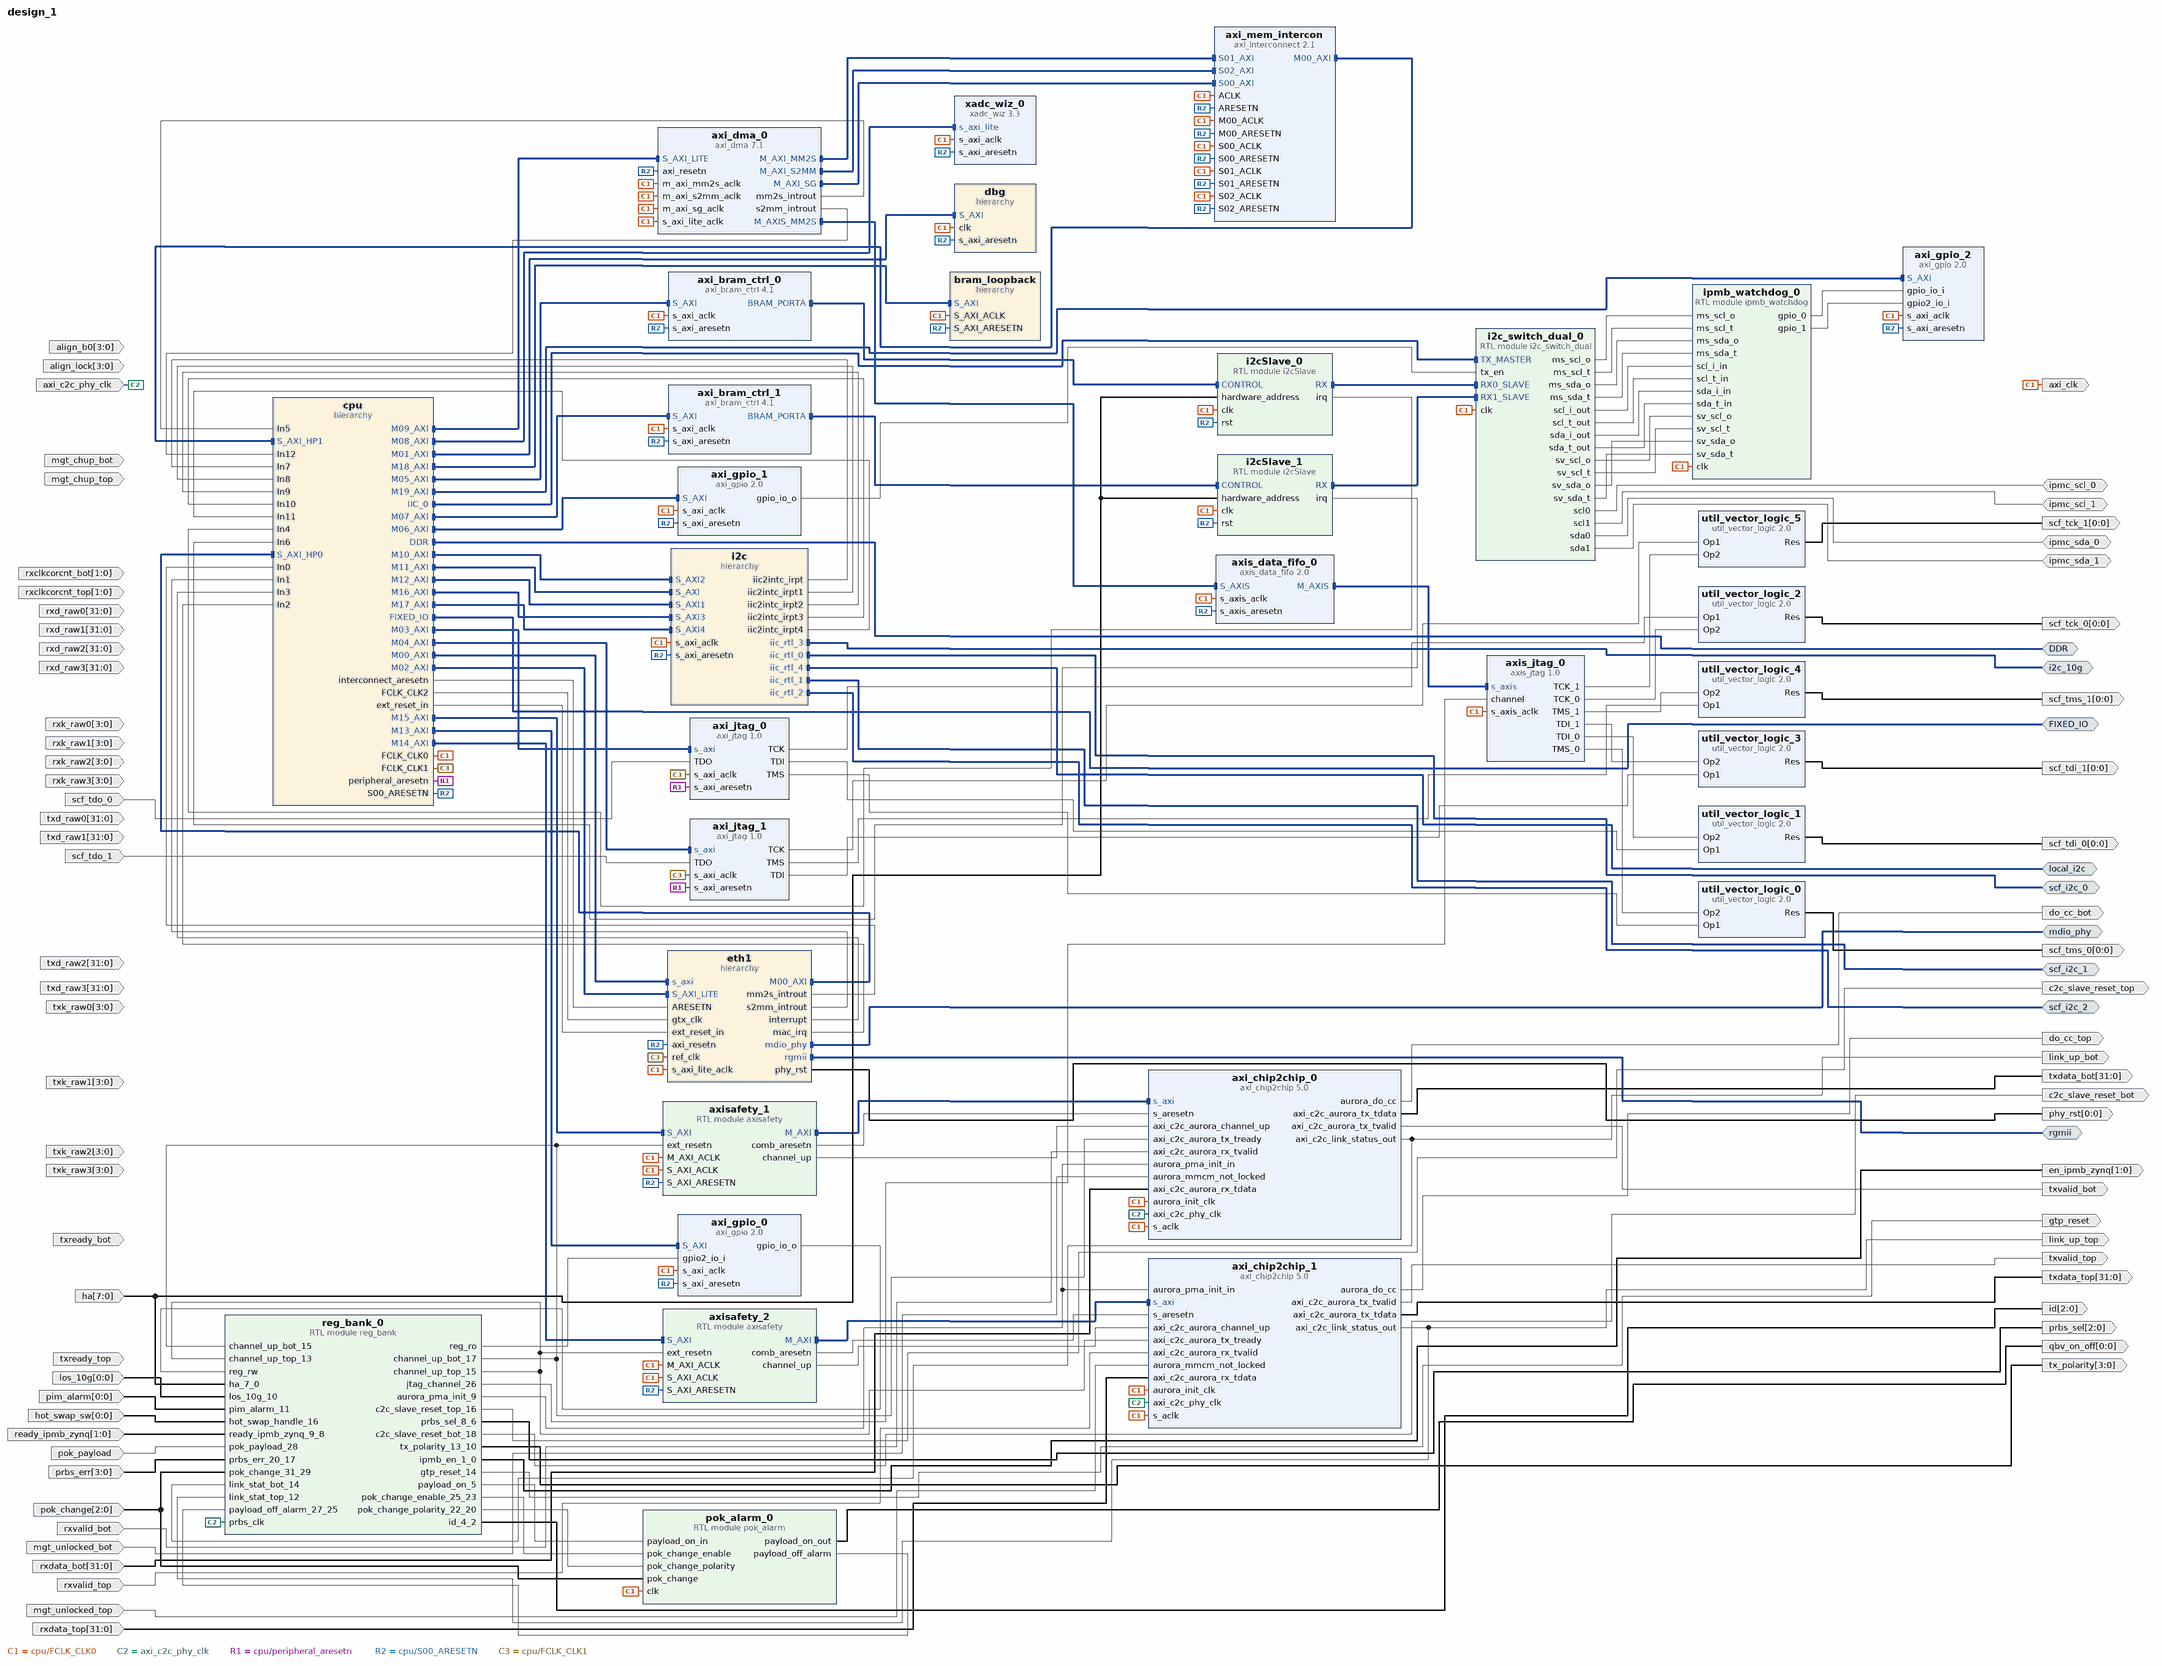
[diagram p0: block diagram of the top level]
# Vivado block design design_1, xc7z015clg485-1, Vivado 2022.2.2
create_bd_design design_1

create_bd_intf_port -mode Master -vlnv xilinx.com:interface:ddrx_rtl:1.0 DDR
create_bd_intf_port -mode Master -vlnv xilinx.com:display_processing_system7:fixedio_rtl:1.0 FIXED_IO
create_bd_intf_port -mode Master -vlnv xilinx.com:interface:mdio_rtl:1.0 mdio_phy
create_bd_intf_port -mode Master -vlnv xilinx.com:interface:rgmii_rtl:1.0 rgmii
create_bd_intf_port -mode Master -vlnv xilinx.com:interface:iic_rtl:1.0 scf_i2c_0
create_bd_intf_port -mode Master -vlnv xilinx.com:interface:iic_rtl:1.0 scf_i2c_1
create_bd_intf_port -mode Master -vlnv xilinx.com:interface:iic_rtl:1.0 scf_i2c_2
create_bd_intf_port -mode Master -vlnv xilinx.com:interface:iic_rtl:1.0 i2c_10g
create_bd_intf_port -mode Master -vlnv xilinx.com:interface:iic_rtl:1.0 local_i2c
create_bd_port -dir O -from 0 -to 0 -type rst phy_rst
set_property -dict {CONFIG.POLARITY ACTIVE_LOW} [get_bd_ports phy_rst]
create_bd_port -dir O -from 0 -to 0 scf_tdi_1
create_bd_port -dir O -from 0 -to 0 scf_tms_1
create_bd_port -dir O -from 0 -to 0 scf_tck_1
create_bd_port -dir I scf_tdo_0
create_bd_port -dir O -from 0 -to 0 scf_tdi_0
create_bd_port -dir O -from 0 -to 0 scf_tms_0
create_bd_port -dir O -from 0 -to 0 scf_tck_0
create_bd_port -dir I scf_tdo_1
create_bd_port -dir IO ipmc_sda_0
create_bd_port -dir IO ipmc_scl_0
create_bd_port -dir IO ipmc_scl_1
create_bd_port -dir IO ipmc_sda_1
create_bd_port -dir O -from 1 -to 0 en_ipmb_zynq
create_bd_port -dir O -from 2 -to 0 id
create_bd_port -dir I -from 1 -to 0 ready_ipmb_zynq
create_bd_port -dir I -from 0 -to 0 los_10g
create_bd_port -dir I -from 7 -to 0 ha
create_bd_port -dir I -from 0 -to 0 pim_alarm
create_bd_port -dir O -from 0 -to 0 qbv_on_off
create_bd_port -dir I -from 0 -to 0 hot_swap_sw
create_bd_port -dir I -type clk axi_c2c_phy_clk
set_property -dict {CONFIG.FREQ_HZ 93750000 CONFIG.PHASE 0} [get_bd_ports axi_c2c_phy_clk]
create_bd_port -dir I -type rst mgt_unlocked_top
set_property -dict {CONFIG.POLARITY ACTIVE_HIGH} [get_bd_ports mgt_unlocked_top]
create_bd_port -dir I -type rst mgt_unlocked_bot
set_property -dict {CONFIG.POLARITY ACTIVE_HIGH} [get_bd_ports mgt_unlocked_bot]
create_bd_port -dir I mgt_chup_top
create_bd_port -dir I mgt_chup_bot
create_bd_port -dir O -from 2 -to 0 prbs_sel
create_bd_port -dir I -from 3 -to 0 prbs_err
create_bd_port -dir O -from 3 -to 0 tx_polarity
create_bd_port -dir I -from 31 -to 0 rxd_raw2
create_bd_port -dir I -from 31 -to 0 rxd_raw3
create_bd_port -dir I -from 3 -to 0 rxk_raw0
create_bd_port -dir I -from 3 -to 0 rxk_raw1
create_bd_port -dir I -from 3 -to 0 rxk_raw2
create_bd_port -dir I -from 3 -to 0 rxk_raw3
create_bd_port -dir I -from 3 -to 0 align_b0
create_bd_port -dir I -from 31 -to 0 rxd_raw0
create_bd_port -dir I -from 31 -to 0 rxd_raw1
create_bd_port -dir I -from 3 -to 0 align_lock
create_bd_port -dir I -from 31 -to 0 rxdata_top
create_bd_port -dir I rxvalid_top
create_bd_port -dir I -from 31 -to 0 rxdata_bot
create_bd_port -dir I rxvalid_bot
create_bd_port -dir O -type clk axi_clk
create_bd_port -dir O -from 31 -to 0 txdata_top
create_bd_port -dir I txready_top
create_bd_port -dir O txvalid_top
create_bd_port -dir I txready_bot
create_bd_port -dir O txvalid_bot
create_bd_port -dir O -from 31 -to 0 txdata_bot
create_bd_port -dir O gtp_reset
create_bd_port -dir O do_cc_bot
create_bd_port -dir O do_cc_top
create_bd_port -dir I -from 1 -to 0 rxclkcorcnt_top
create_bd_port -dir I -from 1 -to 0 rxclkcorcnt_bot
create_bd_port -dir I -from 3 -to 0 txk_raw1
create_bd_port -dir I -from 3 -to 0 txk_raw2
create_bd_port -dir I -from 31 -to 0 txd_raw0
create_bd_port -dir I -from 31 -to 0 txd_raw1
create_bd_port -dir I -from 31 -to 0 txd_raw2
create_bd_port -dir I -from 31 -to 0 txd_raw3
create_bd_port -dir I -from 3 -to 0 txk_raw0
create_bd_port -dir I -from 3 -to 0 txk_raw3
create_bd_port -dir O link_up_top
create_bd_port -dir O link_up_bot
create_bd_port -dir O -type rst c2c_slave_reset_top
create_bd_port -dir O -type rst c2c_slave_reset_bot
create_bd_port -dir I -from 2 -to 0 pok_change
create_bd_port -dir I pok_payload

create_bd_cell -type hier eth1
create_bd_cell -type hier cpu
create_bd_cell -type hier dbg
create_bd_cell -type hier i2c
create_bd_cell -type hier bram_loopback
create_bd_cell -type ip -vlnv A_Clark:Debug:axi_jtag:1.0 axi_jtag_1
set_property -dict {CONFIG.C_TCK_CLOCK_RATIO 20} [get_bd_cells axi_jtag_1]
create_bd_cell -type ip -vlnv A_Clark:Debug:axi_jtag:1.0 axi_jtag_0
set_property -dict {CONFIG.C_TCK_CLOCK_RATIO 20} [get_bd_cells axi_jtag_0]
create_bd_cell -type module -reference pok_alarm pok_alarm_0
create_bd_cell -type ip -vlnv xilinx.com:ip:xadc_wiz:3.3 xadc_wiz_0
set_property -dict [list \
  CONFIG.ENABLE_EXTERNAL_MUX false \
  CONFIG.ENABLE_VCCDDRO_ALARM false \
  CONFIG.ENABLE_VCCPAUX_ALARM false \
  CONFIG.ENABLE_VCCPINT_ALARM false \
  CONFIG.EXTERNAL_MUX_CHANNEL VP_VN \
  CONFIG.OT_ALARM false \
  CONFIG.SINGLE_CHANNEL_SELECTION VP_VN \
  CONFIG.USER_TEMP_ALARM false \
  CONFIG.VCCAUX_ALARM false \
  CONFIG.VCCINT_ALARM false \
] [get_bd_cells xadc_wiz_0]
create_bd_cell -type module -reference reg_bank reg_bank_0
create_bd_cell -type ip -vlnv user.org:user:axis_jtag:1.0 axis_jtag_0
set_property -dict {CONFIG.C_TCK_CLOCK_RATIO 4} [get_bd_cells axis_jtag_0]
create_bd_cell -type module -reference i2c_switch_dual i2c_switch_dual_0
create_bd_cell -type module -reference ipmb_watchdog ipmb_watchdog_0
create_bd_cell -type ip -vlnv xilinx.com:ip:axi_bram_ctrl:4.1 axi_bram_ctrl_0
set_property -dict {CONFIG.SINGLE_PORT_BRAM 1} [get_bd_cells axi_bram_ctrl_0]
create_bd_cell -type ip -vlnv xilinx.com:ip:axi_bram_ctrl:4.1 axi_bram_ctrl_1
set_property -dict {CONFIG.SINGLE_PORT_BRAM 1} [get_bd_cells axi_bram_ctrl_1]
create_bd_cell -type ip -vlnv xilinx.com:ip:axi_chip2chip:5.0 axi_chip2chip_0
set_property -dict [list \
  CONFIG.C_ECC_ENABLE false \
  CONFIG.C_INCLUDE_AXILITE 0 \
  CONFIG.C_INTERFACE_MODE 1 \
  CONFIG.C_INTERFACE_TYPE 3 \
] [get_bd_cells axi_chip2chip_0]
create_bd_cell -type ip -vlnv xilinx.com:ip:axi_chip2chip:5.0 axi_chip2chip_1
set_property -dict [list \
  CONFIG.C_ECC_ENABLE false \
  CONFIG.C_INCLUDE_AXILITE 0 \
  CONFIG.C_INTERFACE_MODE 1 \
  CONFIG.C_INTERFACE_TYPE 3 \
] [get_bd_cells axi_chip2chip_1]
create_bd_cell -type ip -vlnv xilinx.com:ip:axi_dma:7.1 axi_dma_0
set_property -dict [list \
  CONFIG.c_addr_width 32 \
  CONFIG.c_include_s2mm 1 \
  CONFIG.c_m_axi_mm2s_data_width 64 \
  CONFIG.c_m_axi_s2mm_data_width 64 \
  CONFIG.c_m_axis_mm2s_tdata_width 64 \
  CONFIG.c_mm2s_burst_size 128 \
  CONFIG.c_s2mm_burst_size 128 \
  CONFIG.c_s_axis_s2mm_tdata_width 64 \
  CONFIG.c_sg_include_stscntrl_strm 0 \
  CONFIG.c_sg_length_width 26 \
] [get_bd_cells axi_dma_0]
create_bd_cell -type ip -vlnv xilinx.com:ip:axi_gpio:2.0 axi_gpio_0
set_property -dict [list \
  CONFIG.C_ALL_INPUTS_2 1 \
  CONFIG.C_ALL_OUTPUTS 1 \
  CONFIG.C_DOUT_DEFAULT 0x00000000 \
  CONFIG.C_GPIO2_WIDTH 32 \
  CONFIG.C_GPIO_WIDTH 27 \
  CONFIG.C_IS_DUAL 1 \
] [get_bd_cells axi_gpio_0]
create_bd_cell -type ip -vlnv xilinx.com:ip:axi_gpio:2.0 axi_gpio_1
set_property -dict {CONFIG.C_ALL_OUTPUTS 1 CONFIG.C_GPIO_WIDTH 2} [get_bd_cells axi_gpio_1]
create_bd_cell -type ip -vlnv xilinx.com:ip:axi_gpio:2.0 axi_gpio_2
set_property -dict [list \
  CONFIG.C_ALL_INPUTS 1 \
  CONFIG.C_ALL_INPUTS_2 1 \
  CONFIG.C_GPIO_WIDTH 30 \
  CONFIG.C_IS_DUAL 1 \
] [get_bd_cells axi_gpio_2]
create_bd_cell -type ip -vlnv xilinx.com:ip:axi_interconnect:2.1 axi_mem_intercon
set_property -dict {CONFIG.NUM_MI 1 CONFIG.NUM_SI 3} [get_bd_cells axi_mem_intercon]
create_bd_cell -type ip -vlnv xilinx.com:ip:axis_data_fifo:2.0 axis_data_fifo_0
create_bd_cell -type ip -vlnv xilinx.com:ip:util_vector_logic:2.0 util_vector_logic_0
set_property -dict {CONFIG.C_OPERATION or CONFIG.C_SIZE 1} [get_bd_cells util_vector_logic_0]
create_bd_cell -type ip -vlnv xilinx.com:ip:util_vector_logic:2.0 util_vector_logic_1
set_property -dict {CONFIG.C_OPERATION or CONFIG.C_SIZE 1} [get_bd_cells util_vector_logic_1]
create_bd_cell -type ip -vlnv xilinx.com:ip:util_vector_logic:2.0 util_vector_logic_2
set_property -dict {CONFIG.C_OPERATION or CONFIG.C_SIZE 1} [get_bd_cells util_vector_logic_2]
create_bd_cell -type ip -vlnv xilinx.com:ip:util_vector_logic:2.0 util_vector_logic_3
set_property -dict {CONFIG.C_OPERATION or CONFIG.C_SIZE 1} [get_bd_cells util_vector_logic_3]
create_bd_cell -type ip -vlnv xilinx.com:ip:util_vector_logic:2.0 util_vector_logic_4
set_property -dict {CONFIG.C_OPERATION or CONFIG.C_SIZE 1} [get_bd_cells util_vector_logic_4]
create_bd_cell -type ip -vlnv xilinx.com:ip:util_vector_logic:2.0 util_vector_logic_5
set_property -dict {CONFIG.C_OPERATION or CONFIG.C_SIZE 1} [get_bd_cells util_vector_logic_5]
create_bd_cell -type module -reference i2cSlave i2cSlave_0
create_bd_cell -type module -reference i2cSlave i2cSlave_1
create_bd_cell -type module -reference axisafety axisafety_1
set_property -dict [list \
  CONFIG.C_S_AXI_ADDR_WIDTH 28 \
  CONFIG.C_S_AXI_ID_WIDTH 6 \
  CONFIG.OPT_SELF_RESET 1 \
  CONFIG.OPT_TIMEOUT 100000 \
] [get_bd_cells axisafety_1]
create_bd_cell -type module -reference axisafety axisafety_2
set_property -dict [list \
  CONFIG.C_S_AXI_ADDR_WIDTH 28 \
  CONFIG.C_S_AXI_ID_WIDTH 6 \
  CONFIG.OPT_SELF_RESET 1 \
  CONFIG.OPT_TIMEOUT 100000 \
] [get_bd_cells axisafety_2]

# ---- hierarchy /eth1 ----
current_bd_instance /eth1
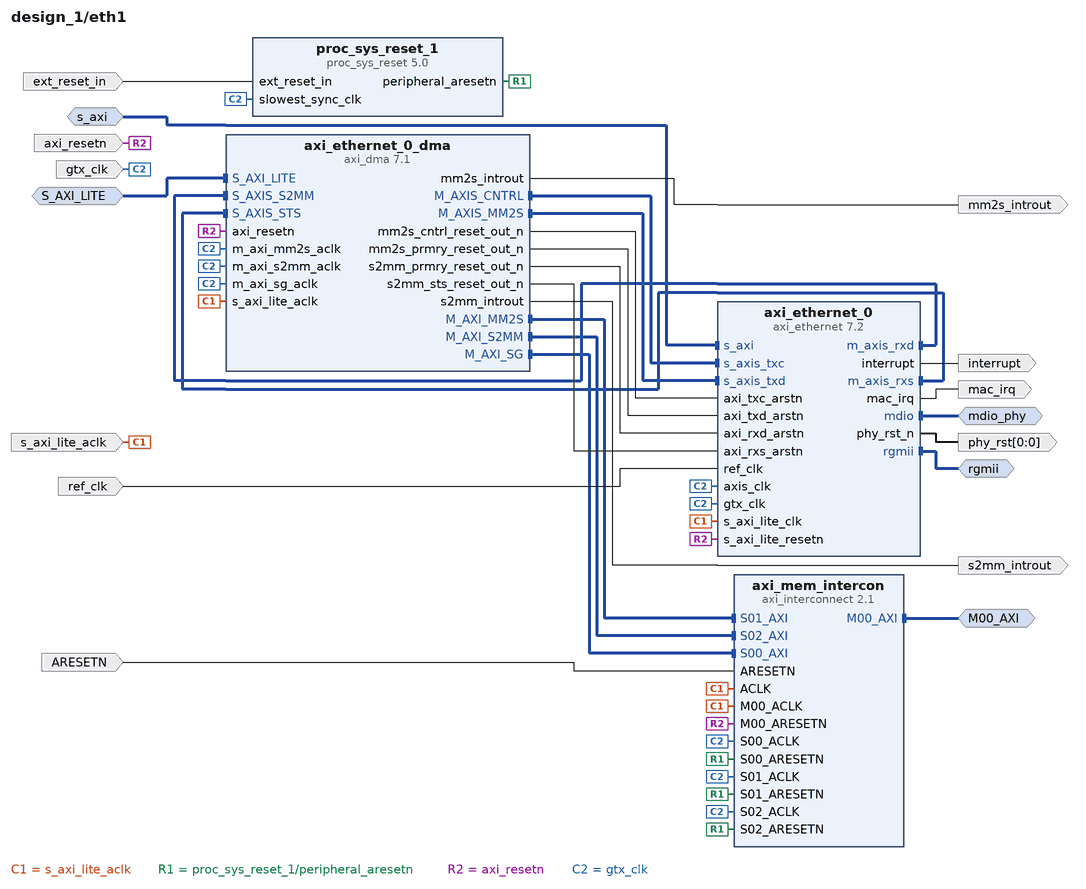
[diagram p1: block diagram inside /eth1]
create_bd_intf_pin -mode Slave -vlnv xilinx.com:interface:aximm_rtl:1.0 s_axi
create_bd_intf_pin -mode Master -vlnv xilinx.com:interface:mdio_rtl:1.0 mdio_phy
create_bd_intf_pin -mode Master -vlnv xilinx.com:interface:rgmii_rtl:1.0 rgmii
create_bd_intf_pin -mode Slave -vlnv xilinx.com:interface:aximm_rtl:1.0 S_AXI_LITE
create_bd_intf_pin -mode Master -vlnv xilinx.com:interface:aximm_rtl:1.0 M00_AXI
create_bd_pin -dir I -type rst axi_resetn
create_bd_pin -dir I -type clk s_axi_lite_aclk
create_bd_pin -dir O -type intr mac_irq
create_bd_pin -dir I -type clk gtx_clk
create_bd_pin -dir O -type intr interrupt
create_bd_pin -dir O -from 0 -to 0 -type rst phy_rst
create_bd_pin -dir I -type clk ref_clk
create_bd_pin -dir O -type intr mm2s_introut
create_bd_pin -dir O -type intr s2mm_introut
create_bd_pin -dir I -type rst ARESETN
create_bd_pin -dir I -type rst ext_reset_in

create_bd_cell -type ip -vlnv xilinx.com:ip:proc_sys_reset:5.0 proc_sys_reset_1
create_bd_cell -type ip -vlnv xilinx.com:ip:axi_ethernet:7.2 axi_ethernet_0
set_property -dict {CONFIG.PHY_TYPE RGMII} [get_bd_cells axi_ethernet_0]
create_bd_cell -type ip -vlnv xilinx.com:ip:axi_dma:7.1 axi_ethernet_0_dma
set_property -dict [list \
  CONFIG.c_include_mm2s_dre 1 \
  CONFIG.c_include_s2mm_dre 1 \
  CONFIG.c_sg_length_width 16 \
  CONFIG.c_sg_use_stsapp_length 1 \
] [get_bd_cells axi_ethernet_0_dma]
create_bd_cell -type ip -vlnv xilinx.com:ip:axi_interconnect:2.1 axi_mem_intercon
set_property -dict {CONFIG.NUM_MI 1 CONFIG.NUM_SI 3} [get_bd_cells axi_mem_intercon]

# ---- hierarchy /cpu ----
current_bd_instance /cpu
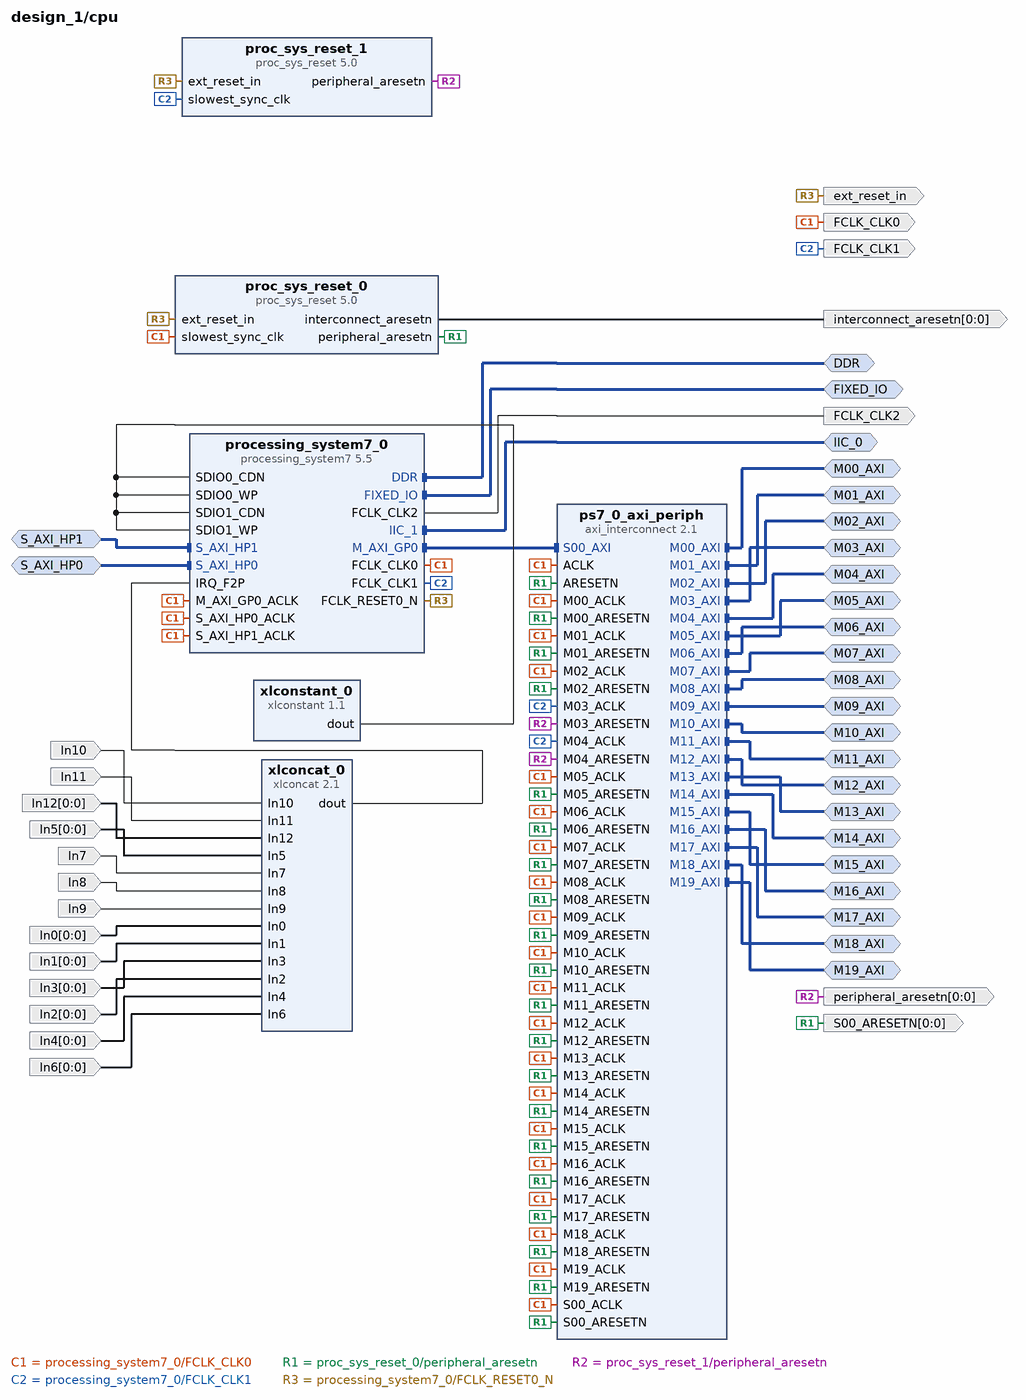
[diagram p2: block diagram inside /cpu]
create_bd_intf_pin -mode Master -vlnv xilinx.com:interface:ddrx_rtl:1.0 DDR
create_bd_intf_pin -mode Master -vlnv xilinx.com:display_processing_system7:fixedio_rtl:1.0 FIXED_IO
create_bd_intf_pin -mode Slave -vlnv xilinx.com:interface:aximm_rtl:1.0 S_AXI_HP0
create_bd_intf_pin -mode Master -vlnv xilinx.com:interface:aximm_rtl:1.0 M00_AXI
create_bd_intf_pin -mode Master -vlnv xilinx.com:interface:aximm_rtl:1.0 M01_AXI
create_bd_intf_pin -mode Master -vlnv xilinx.com:interface:aximm_rtl:1.0 M02_AXI
create_bd_intf_pin -mode Master -vlnv xilinx.com:interface:aximm_rtl:1.0 M03_AXI
create_bd_intf_pin -mode Master -vlnv xilinx.com:interface:aximm_rtl:1.0 M04_AXI
create_bd_intf_pin -mode Master -vlnv xilinx.com:interface:aximm_rtl:1.0 M05_AXI
create_bd_intf_pin -mode Master -vlnv xilinx.com:interface:aximm_rtl:1.0 M06_AXI
create_bd_intf_pin -mode Master -vlnv xilinx.com:interface:aximm_rtl:1.0 M07_AXI
create_bd_intf_pin -mode Master -vlnv xilinx.com:interface:aximm_rtl:1.0 M10_AXI
create_bd_intf_pin -mode Master -vlnv xilinx.com:interface:aximm_rtl:1.0 M11_AXI
create_bd_intf_pin -mode Master -vlnv xilinx.com:interface:aximm_rtl:1.0 M12_AXI
create_bd_intf_pin -mode Master -vlnv xilinx.com:interface:aximm_rtl:1.0 M13_AXI
create_bd_intf_pin -mode Master -vlnv xilinx.com:interface:aximm_rtl:1.0 M14_AXI
create_bd_intf_pin -mode Master -vlnv xilinx.com:interface:aximm_rtl:1.0 M15_AXI
create_bd_intf_pin -mode Master -vlnv xilinx.com:interface:aximm_rtl:1.0 M16_AXI
create_bd_intf_pin -mode Master -vlnv xilinx.com:interface:aximm_rtl:1.0 M17_AXI
create_bd_intf_pin -mode Master -vlnv xilinx.com:interface:aximm_rtl:1.0 M18_AXI
create_bd_intf_pin -mode Master -vlnv xilinx.com:interface:iic_rtl:1.0 IIC_0
create_bd_intf_pin -mode Master -vlnv xilinx.com:interface:aximm_rtl:1.0 M08_AXI
create_bd_intf_pin -mode Master -vlnv xilinx.com:interface:aximm_rtl:1.0 M09_AXI
create_bd_intf_pin -mode Slave -vlnv xilinx.com:interface:aximm_rtl:1.0 S_AXI_HP1
create_bd_intf_pin -mode Master -vlnv xilinx.com:interface:aximm_rtl:1.0 M19_AXI
create_bd_pin -dir O -type clk FCLK_CLK0
create_bd_pin -dir O -type clk FCLK_CLK1
create_bd_pin -dir O -type clk FCLK_CLK2
create_bd_pin -dir O -type rst ext_reset_in
create_bd_pin -dir I -from 0 -to 0 In0
create_bd_pin -dir I -from 0 -to 0 In1
create_bd_pin -dir I -from 0 -to 0 In2
create_bd_pin -dir I -from 0 -to 0 In3
create_bd_pin -dir I -from 0 -to 0 In4
create_bd_pin -dir I -from 0 -to 0 In6
create_bd_pin -dir O -from 0 -to 0 -type rst interconnect_aresetn
create_bd_pin -dir O -from 0 -to 0 -type rst S00_ARESETN
create_bd_pin -dir I -type intr In7
create_bd_pin -dir I -type intr In8
create_bd_pin -dir I -type intr In9
create_bd_pin -dir I -type intr In10
create_bd_pin -dir I -type intr In11
create_bd_pin -dir O -from 0 -to 0 -type rst peripheral_aresetn
create_bd_pin -dir I -from 0 -to 0 In5
create_bd_pin -dir I -from 0 -to 0 In12

create_bd_cell -type ip -vlnv xilinx.com:ip:processing_system7:5.5 processing_system7_0
set_property -dict [list \
  CONFIG.PCW_APU_PERIPHERAL_FREQMHZ 666.666666 \
  CONFIG.PCW_CAN1_CAN1_IO {MIO 8 .. 9} \
  CONFIG.PCW_CAN1_PERIPHERAL_ENABLE 1 \
  CONFIG.PCW_ENET0_ENET0_IO {MIO 16 .. 27} \
  CONFIG.PCW_ENET0_GRP_MDIO_ENABLE 1 \
  CONFIG.PCW_ENET0_GRP_MDIO_IO {MIO 52 .. 53} \
  CONFIG.PCW_ENET0_PERIPHERAL_ENABLE 1 \
  CONFIG.PCW_ENET0_RESET_ENABLE 0 \
  CONFIG.PCW_ENET1_PERIPHERAL_CLKSRC External \
  CONFIG.PCW_ENET_RESET_ENABLE 1 \
  CONFIG.PCW_ENET_RESET_SELECT {Share reset pin} \
  CONFIG.PCW_EN_CLK1_PORT 1 \
  CONFIG.PCW_EN_CLK2_PORT 1 \
  CONFIG.PCW_FCLK_CLK0_BUF FALSE \
  CONFIG.PCW_FCLK_CLK1_BUF TRUE \
  CONFIG.PCW_FPGA0_PERIPHERAL_FREQMHZ 100 \
  CONFIG.PCW_FPGA1_PERIPHERAL_FREQMHZ 200 \
  CONFIG.PCW_FPGA2_PERIPHERAL_FREQMHZ 125 \
  CONFIG.PCW_FPGA_FCLK1_ENABLE 1 \
  CONFIG.PCW_FPGA_FCLK2_ENABLE 1 \
  CONFIG.PCW_GP0_EN_MODIFIABLE_TXN 0 \
  CONFIG.PCW_GP1_EN_MODIFIABLE_TXN 0 \
  CONFIG.PCW_GPIO_MIO_GPIO_ENABLE 1 \
  CONFIG.PCW_GPIO_MIO_GPIO_IO MIO \
  CONFIG.PCW_I2C1_I2C1_IO EMIO \
  CONFIG.PCW_I2C1_PERIPHERAL_ENABLE 1 \
  CONFIG.PCW_I2C_PERIPHERAL_FREQMHZ 111.111115 \
  CONFIG.PCW_I2C_RESET_ENABLE 1 \
  CONFIG.PCW_I2C_RESET_SELECT {Share reset pin} \
  CONFIG.PCW_IRQ_F2P_INTR 1 \
  CONFIG.PCW_M_AXI_GP0_ENABLE_STATIC_REMAP 1 \
  CONFIG.PCW_M_AXI_GP0_FREQMHZ 62 \
  CONFIG.PCW_M_AXI_GP0_THREAD_ID_WIDTH 6 \
  CONFIG.PCW_PERIPHERAL_BOARD_PRESET None \
  CONFIG.PCW_PRESET_BANK1_VOLTAGE {LVCMOS 1.8V} \
  CONFIG.PCW_QSPI_GRP_SINGLE_SS_ENABLE 1 \
  CONFIG.PCW_QSPI_GRP_SINGLE_SS_IO {MIO 1 .. 6} \
  CONFIG.PCW_QSPI_PERIPHERAL_ENABLE 1 \
  CONFIG.PCW_QSPI_QSPI_IO {MIO 1 .. 6} \
  CONFIG.PCW_SD0_GRP_CD_ENABLE 1 \
  CONFIG.PCW_SD0_GRP_CD_IO EMIO \
  CONFIG.PCW_SD0_GRP_WP_ENABLE 1 \
  CONFIG.PCW_SD0_GRP_WP_IO EMIO \
  CONFIG.PCW_SD0_PERIPHERAL_ENABLE 1 \
  CONFIG.PCW_SD0_SD0_IO {MIO 40 .. 45} \
  CONFIG.PCW_SD1_GRP_CD_ENABLE 1 \
  CONFIG.PCW_SD1_GRP_CD_IO EMIO \
  CONFIG.PCW_SD1_GRP_WP_ENABLE 1 \
  CONFIG.PCW_SD1_GRP_WP_IO EMIO \
  CONFIG.PCW_SD1_PERIPHERAL_ENABLE 1 \
  CONFIG.PCW_SD1_SD1_IO {MIO 10 .. 15} \
  CONFIG.PCW_SDIO_PERIPHERAL_FREQMHZ 50 \
  CONFIG.PCW_SINGLE_QSPI_DATA_MODE x4 \
  CONFIG.PCW_S_AXI_HP0_FREQMHZ 62 \
  CONFIG.PCW_UART1_PERIPHERAL_ENABLE 1 \
  CONFIG.PCW_UART1_UART1_IO {MIO 48 .. 49} \
  CONFIG.PCW_UART_PERIPHERAL_FREQMHZ 100 \
  CONFIG.PCW_UIPARAM_DDR_FREQ_MHZ 533.333333 \
  CONFIG.PCW_UIPARAM_DDR_PARTNO {MT41J256M16 RE-125} \
  CONFIG.PCW_USB0_PERIPHERAL_ENABLE 1 \
  CONFIG.PCW_USB0_RESET_ENABLE 1 \
  CONFIG.PCW_USB0_RESET_IO {MIO 7} \
  CONFIG.PCW_USB0_USB0_IO {MIO 28 .. 39} \
  CONFIG.PCW_USB_RESET_ENABLE 1 \
  CONFIG.PCW_USB_RESET_SELECT {Share reset pin} \
  CONFIG.PCW_USE_FABRIC_INTERRUPT 1 \
  CONFIG.PCW_USE_S_AXI_HP0 1 \
  CONFIG.PCW_USE_S_AXI_HP1 1 \
  CONFIG.preset None \
] [get_bd_cells processing_system7_0]
# 514 more settings of processing_system7_0 are not shown: defaults, MIO pin electricals, DDR timing, and values the tool derives
create_bd_cell -type ip -vlnv xilinx.com:ip:xlconstant:1.1 xlconstant_0
set_property -dict {CONFIG.CONST_VAL 0} [get_bd_cells xlconstant_0]
create_bd_cell -type ip -vlnv xilinx.com:ip:proc_sys_reset:5.0 proc_sys_reset_0
create_bd_cell -type ip -vlnv xilinx.com:ip:xlconcat:2.1 xlconcat_0
set_property -dict {CONFIG.NUM_PORTS 13 CONFIG.dout_width 13} [get_bd_cells xlconcat_0]
create_bd_cell -type ip -vlnv xilinx.com:ip:proc_sys_reset:5.0 proc_sys_reset_1
create_bd_cell -type ip -vlnv xilinx.com:ip:axi_interconnect:2.1 ps7_0_axi_periph
set_property -dict [list \
  CONFIG.ENABLE_ADVANCED_OPTIONS 1 \
  CONFIG.M00_HAS_REGSLICE 4 \
  CONFIG.M01_HAS_REGSLICE 4 \
  CONFIG.M02_HAS_REGSLICE 4 \
  CONFIG.M03_HAS_REGSLICE 4 \
  CONFIG.NUM_MI 20 \
  CONFIG.S00_HAS_DATA_FIFO 2 \
  CONFIG.S00_HAS_REGSLICE 4 \
  CONFIG.STRATEGY 2 \
] [get_bd_cells ps7_0_axi_periph]

# ---- hierarchy /dbg ----
current_bd_instance /dbg
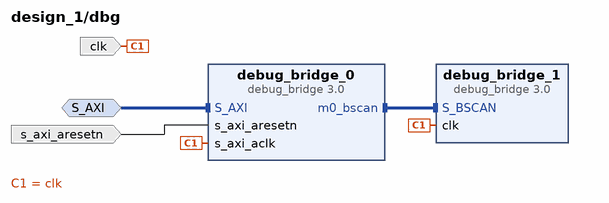
[diagram p3: block diagram inside /dbg]
create_bd_intf_pin -mode Slave -vlnv xilinx.com:interface:aximm_rtl:1.0 S_AXI
create_bd_pin -dir I -type clk clk
create_bd_pin -dir I -type rst s_axi_aresetn

create_bd_cell -type ip -vlnv xilinx.com:ip:debug_bridge:3.0 debug_bridge_0
set_property -dict [list \
  CONFIG.C_BSCAN_MUX 1 \
  CONFIG.C_DEBUG_MODE 2 \
  CONFIG.C_NUM_BS_MASTER 1 \
  CONFIG.C_XVC_HW_ID 0x0001 \
] [get_bd_cells debug_bridge_0]
create_bd_cell -type ip -vlnv xilinx.com:ip:debug_bridge:3.0 debug_bridge_1

# ---- hierarchy /i2c ----
current_bd_instance /i2c
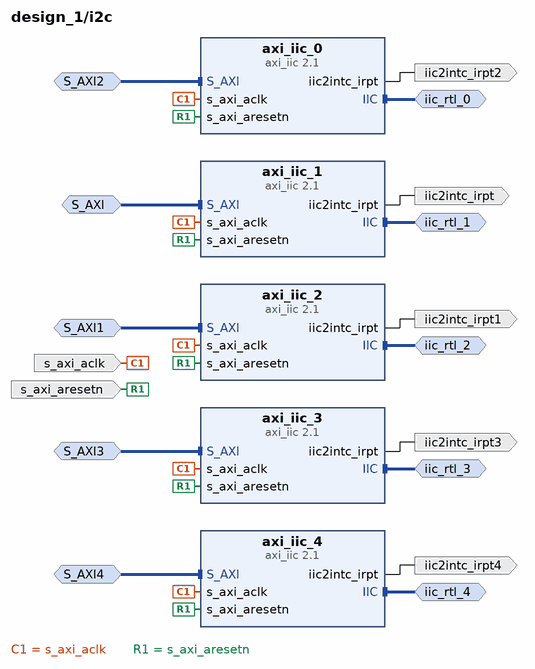
[diagram p4: block diagram inside /i2c]
create_bd_intf_pin -mode Slave -vlnv xilinx.com:interface:aximm_rtl:1.0 S_AXI
create_bd_intf_pin -mode Master -vlnv xilinx.com:interface:iic_rtl:1.0 iic_rtl_1
create_bd_intf_pin -mode Slave -vlnv xilinx.com:interface:aximm_rtl:1.0 S_AXI1
create_bd_intf_pin -mode Master -vlnv xilinx.com:interface:iic_rtl:1.0 iic_rtl_2
create_bd_intf_pin -mode Slave -vlnv xilinx.com:interface:aximm_rtl:1.0 S_AXI2
create_bd_intf_pin -mode Master -vlnv xilinx.com:interface:iic_rtl:1.0 iic_rtl_0
create_bd_intf_pin -mode Master -vlnv xilinx.com:interface:iic_rtl:1.0 iic_rtl_3
create_bd_intf_pin -mode Slave -vlnv xilinx.com:interface:aximm_rtl:1.0 S_AXI3
create_bd_intf_pin -mode Master -vlnv xilinx.com:interface:iic_rtl:1.0 iic_rtl_4
create_bd_intf_pin -mode Slave -vlnv xilinx.com:interface:aximm_rtl:1.0 S_AXI4
create_bd_pin -dir I -type clk s_axi_aclk
create_bd_pin -dir I -type rst s_axi_aresetn
create_bd_pin -dir O -type intr iic2intc_irpt
create_bd_pin -dir O -type intr iic2intc_irpt1
create_bd_pin -dir O -type intr iic2intc_irpt2
create_bd_pin -dir O -type intr iic2intc_irpt3
create_bd_pin -dir O -type intr iic2intc_irpt4

create_bd_cell -type ip -vlnv xilinx.com:ip:axi_iic:2.1 axi_iic_0
set_property -dict {CONFIG.C_SCL_INERTIAL_DELAY 10 CONFIG.C_SDA_INERTIAL_DELAY 10} [get_bd_cells axi_iic_0]
create_bd_cell -type ip -vlnv xilinx.com:ip:axi_iic:2.1 axi_iic_1
set_property -dict {CONFIG.C_SCL_INERTIAL_DELAY 10 CONFIG.C_SDA_INERTIAL_DELAY 10} [get_bd_cells axi_iic_1]
create_bd_cell -type ip -vlnv xilinx.com:ip:axi_iic:2.1 axi_iic_2
set_property -dict {CONFIG.C_SCL_INERTIAL_DELAY 10 CONFIG.C_SDA_INERTIAL_DELAY 10} [get_bd_cells axi_iic_2]
create_bd_cell -type ip -vlnv xilinx.com:ip:axi_iic:2.1 axi_iic_3
set_property -dict {CONFIG.C_SCL_INERTIAL_DELAY 10 CONFIG.C_SDA_INERTIAL_DELAY 10} [get_bd_cells axi_iic_3]
create_bd_cell -type ip -vlnv xilinx.com:ip:axi_iic:2.1 axi_iic_4
set_property -dict {CONFIG.C_SCL_INERTIAL_DELAY 10 CONFIG.C_SDA_INERTIAL_DELAY 10} [get_bd_cells axi_iic_4]

# ---- hierarchy /bram_loopback ----
current_bd_instance /bram_loopback
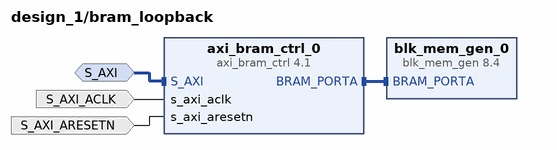
[diagram p5: block diagram inside /bram_loopback]
create_bd_intf_pin -mode Slave -vlnv xilinx.com:interface:aximm_rtl:1.0 S_AXI
create_bd_pin -dir I -type clk S_AXI_ACLK
create_bd_pin -dir I -type rst S_AXI_ARESETN

create_bd_cell -type ip -vlnv xilinx.com:ip:axi_bram_ctrl:4.1 axi_bram_ctrl_0
set_property -dict {CONFIG.SINGLE_PORT_BRAM 1} [get_bd_cells axi_bram_ctrl_0]
create_bd_cell -type ip -vlnv xilinx.com:ip:blk_mem_gen:8.4 blk_mem_gen_0

# ---- connections ----

current_bd_instance /eth1
connect_bd_intf_net [get_bd_intf_pins axi_ethernet_0_dma/M_AXIS_CNTRL] [get_bd_intf_pins axi_ethernet_0/s_axis_txc]
connect_bd_intf_net [get_bd_intf_pins axi_ethernet_0_dma/M_AXIS_MM2S] [get_bd_intf_pins axi_ethernet_0/s_axis_txd]
connect_bd_intf_net [get_bd_intf_pins axi_ethernet_0_dma/M_AXI_MM2S] [get_bd_intf_pins axi_mem_intercon/S01_AXI]
connect_bd_intf_net [get_bd_intf_pins axi_ethernet_0_dma/M_AXI_S2MM] [get_bd_intf_pins axi_mem_intercon/S02_AXI]
connect_bd_intf_net [get_bd_intf_pins axi_ethernet_0_dma/M_AXI_SG] [get_bd_intf_pins axi_mem_intercon/S00_AXI]
connect_bd_intf_net [get_bd_intf_pins axi_ethernet_0_dma/S_AXIS_S2MM] [get_bd_intf_pins axi_ethernet_0/m_axis_rxd]
connect_bd_intf_net [get_bd_intf_pins axi_ethernet_0_dma/S_AXIS_STS] [get_bd_intf_pins axi_ethernet_0/m_axis_rxs]
connect_bd_intf_net [get_bd_intf_pins mdio_phy] [get_bd_intf_pins axi_ethernet_0/mdio]
connect_bd_intf_net [get_bd_intf_pins rgmii] [get_bd_intf_pins axi_ethernet_0/rgmii]
connect_bd_intf_net [get_bd_intf_pins M00_AXI] [get_bd_intf_pins axi_mem_intercon/M00_AXI]
connect_bd_intf_net [get_bd_intf_pins s_axi] [get_bd_intf_pins axi_ethernet_0/s_axi]
connect_bd_intf_net [get_bd_intf_pins S_AXI_LITE] [get_bd_intf_pins axi_ethernet_0_dma/S_AXI_LITE]
connect_bd_net [get_bd_pins ARESETN] [get_bd_pins axi_mem_intercon/ARESETN]
connect_bd_net [get_bd_pins s_axi_lite_aclk] \
  [get_bd_pins axi_ethernet_0/s_axi_lite_clk] [get_bd_pins axi_ethernet_0_dma/s_axi_lite_aclk] \
  [get_bd_pins axi_mem_intercon/ACLK] [get_bd_pins axi_mem_intercon/M00_ACLK]
connect_bd_net -net S00_ARESETN_1 [get_bd_pins proc_sys_reset_1/peripheral_aresetn] \
  [get_bd_pins axi_mem_intercon/S00_ARESETN] [get_bd_pins axi_mem_intercon/S01_ARESETN] \
  [get_bd_pins axi_mem_intercon/S02_ARESETN]
connect_bd_net [get_bd_pins axi_ethernet_0_dma/mm2s_cntrl_reset_out_n] [get_bd_pins axi_ethernet_0/axi_txc_arstn]
connect_bd_net [get_bd_pins axi_ethernet_0_dma/mm2s_introut] [get_bd_pins mm2s_introut]
connect_bd_net [get_bd_pins axi_ethernet_0_dma/mm2s_prmry_reset_out_n] [get_bd_pins axi_ethernet_0/axi_txd_arstn]
connect_bd_net [get_bd_pins axi_ethernet_0_dma/s2mm_introut] [get_bd_pins s2mm_introut]
connect_bd_net [get_bd_pins axi_ethernet_0_dma/s2mm_prmry_reset_out_n] [get_bd_pins axi_ethernet_0/axi_rxd_arstn]
connect_bd_net [get_bd_pins axi_ethernet_0_dma/s2mm_sts_reset_out_n] [get_bd_pins axi_ethernet_0/axi_rxs_arstn]
connect_bd_net [get_bd_pins axi_ethernet_0/interrupt] [get_bd_pins interrupt]
connect_bd_net [get_bd_pins axi_ethernet_0/mac_irq] [get_bd_pins mac_irq]
connect_bd_net [get_bd_pins axi_ethernet_0/phy_rst_n] [get_bd_pins phy_rst]
connect_bd_net [get_bd_pins ext_reset_in] [get_bd_pins proc_sys_reset_1/ext_reset_in]
connect_bd_net -net proc_sys_reset_0_peripheral_aresetn [get_bd_pins axi_resetn] \
  [get_bd_pins axi_ethernet_0/s_axi_lite_resetn] [get_bd_pins axi_ethernet_0_dma/axi_resetn] \
  [get_bd_pins axi_mem_intercon/M00_ARESETN]
connect_bd_net -net processing_system7_0_FCLK_CLK1 [get_bd_pins ref_clk] [get_bd_pins axi_ethernet_0/ref_clk]
connect_bd_net -net processing_system7_0_FCLK_CLK2 [get_bd_pins gtx_clk] \
  [get_bd_pins proc_sys_reset_1/slowest_sync_clk] [get_bd_pins axi_ethernet_0/axis_clk] [get_bd_pins axi_ethernet_0/gtx_clk] \
  [get_bd_pins axi_ethernet_0_dma/m_axi_sg_aclk] [get_bd_pins axi_ethernet_0_dma/m_axi_mm2s_aclk] \
  [get_bd_pins axi_ethernet_0_dma/m_axi_s2mm_aclk] [get_bd_pins axi_mem_intercon/S00_ACLK] \
  [get_bd_pins axi_mem_intercon/S01_ACLK] [get_bd_pins axi_mem_intercon/S02_ACLK]

current_bd_instance /cpu
connect_bd_intf_net [get_bd_intf_pins M10_AXI] [get_bd_intf_pins ps7_0_axi_periph/M10_AXI]
connect_bd_intf_net [get_bd_intf_pins M11_AXI] [get_bd_intf_pins ps7_0_axi_periph/M11_AXI]
connect_bd_intf_net [get_bd_intf_pins M12_AXI] [get_bd_intf_pins ps7_0_axi_periph/M12_AXI]
connect_bd_intf_net [get_bd_intf_pins M13_AXI] [get_bd_intf_pins ps7_0_axi_periph/M13_AXI]
connect_bd_intf_net [get_bd_intf_pins M14_AXI] [get_bd_intf_pins ps7_0_axi_periph/M14_AXI]
connect_bd_intf_net [get_bd_intf_pins M15_AXI] [get_bd_intf_pins ps7_0_axi_periph/M15_AXI]
connect_bd_intf_net [get_bd_intf_pins M18_AXI] [get_bd_intf_pins ps7_0_axi_periph/M18_AXI]
connect_bd_intf_net [get_bd_intf_pins M08_AXI] [get_bd_intf_pins ps7_0_axi_periph/M08_AXI]
connect_bd_intf_net [get_bd_intf_pins M09_AXI] [get_bd_intf_pins ps7_0_axi_periph/M09_AXI]
connect_bd_intf_net [get_bd_intf_pins S_AXI_HP1] [get_bd_intf_pins processing_system7_0/S_AXI_HP1]
connect_bd_intf_net [get_bd_intf_pins M19_AXI] [get_bd_intf_pins ps7_0_axi_periph/M19_AXI]
connect_bd_intf_net -intf_net S_AXI2_1 [get_bd_intf_pins M05_AXI] [get_bd_intf_pins ps7_0_axi_periph/M05_AXI]
connect_bd_intf_net -intf_net S_AXI3_1 [get_bd_intf_pins M06_AXI] [get_bd_intf_pins ps7_0_axi_periph/M06_AXI]
connect_bd_intf_net -intf_net S_AXI4_1 [get_bd_intf_pins M07_AXI] [get_bd_intf_pins ps7_0_axi_periph/M07_AXI]
connect_bd_intf_net -intf_net axi_mem_intercon_M00_AXI [get_bd_intf_pins S_AXI_HP0] [get_bd_intf_pins processing_system7_0/S_AXI_HP0]
connect_bd_intf_net [get_bd_intf_pins DDR] [get_bd_intf_pins processing_system7_0/DDR]
connect_bd_intf_net [get_bd_intf_pins FIXED_IO] [get_bd_intf_pins processing_system7_0/FIXED_IO]
connect_bd_intf_net [get_bd_intf_pins IIC_0] [get_bd_intf_pins processing_system7_0/IIC_1]
connect_bd_intf_net [get_bd_intf_pins processing_system7_0/M_AXI_GP0] [get_bd_intf_pins ps7_0_axi_periph/S00_AXI]
connect_bd_intf_net [get_bd_intf_pins M00_AXI] [get_bd_intf_pins ps7_0_axi_periph/M00_AXI]
connect_bd_intf_net [get_bd_intf_pins M01_AXI] [get_bd_intf_pins ps7_0_axi_periph/M01_AXI]
connect_bd_intf_net [get_bd_intf_pins M02_AXI] [get_bd_intf_pins ps7_0_axi_periph/M02_AXI]
connect_bd_intf_net [get_bd_intf_pins M16_AXI] [get_bd_intf_pins ps7_0_axi_periph/M16_AXI]
connect_bd_intf_net [get_bd_intf_pins M17_AXI] [get_bd_intf_pins ps7_0_axi_periph/M17_AXI]
connect_bd_intf_net -intf_net s_axi1_1 [get_bd_intf_pins M04_AXI] [get_bd_intf_pins ps7_0_axi_periph/M04_AXI]
connect_bd_intf_net -intf_net s_axi_1 [get_bd_intf_pins M03_AXI] [get_bd_intf_pins ps7_0_axi_periph/M03_AXI]
connect_bd_net -net ARESETN_1 [get_bd_pins proc_sys_reset_0/interconnect_aresetn] [get_bd_pins interconnect_aresetn]
connect_bd_net -net In10_1 [get_bd_pins In10] [get_bd_pins xlconcat_0/In10]
connect_bd_net -net In11_1 [get_bd_pins In11] [get_bd_pins xlconcat_0/In11]
connect_bd_net -net In12_1 [get_bd_pins In12] [get_bd_pins xlconcat_0/In12]
connect_bd_net -net In5_1 [get_bd_pins In5] [get_bd_pins xlconcat_0/In5]
connect_bd_net -net In7_1 [get_bd_pins In7] [get_bd_pins xlconcat_0/In7]
connect_bd_net -net In8_1 [get_bd_pins In8] [get_bd_pins xlconcat_0/In8]
connect_bd_net -net In9_1 [get_bd_pins In9] [get_bd_pins xlconcat_0/In9]
connect_bd_net [get_bd_pins processing_system7_0/FCLK_CLK0] \
  [get_bd_pins FCLK_CLK0] [get_bd_pins proc_sys_reset_0/slowest_sync_clk] [get_bd_pins processing_system7_0/S_AXI_HP0_ACLK] \
  [get_bd_pins processing_system7_0/M_AXI_GP0_ACLK] [get_bd_pins processing_system7_0/S_AXI_HP1_ACLK] \
  [get_bd_pins ps7_0_axi_periph/ACLK] [get_bd_pins ps7_0_axi_periph/S00_ACLK] [get_bd_pins ps7_0_axi_periph/M00_ACLK] \
  [get_bd_pins ps7_0_axi_periph/M01_ACLK] [get_bd_pins ps7_0_axi_periph/M02_ACLK] [get_bd_pins ps7_0_axi_periph/M05_ACLK] \
  [get_bd_pins ps7_0_axi_periph/M06_ACLK] [get_bd_pins ps7_0_axi_periph/M07_ACLK] [get_bd_pins ps7_0_axi_periph/M08_ACLK] \
  [get_bd_pins ps7_0_axi_periph/M09_ACLK] [get_bd_pins ps7_0_axi_periph/M10_ACLK] [get_bd_pins ps7_0_axi_periph/M11_ACLK] \
  [get_bd_pins ps7_0_axi_periph/M12_ACLK] [get_bd_pins ps7_0_axi_periph/M13_ACLK] [get_bd_pins ps7_0_axi_periph/M14_ACLK] \
  [get_bd_pins ps7_0_axi_periph/M15_ACLK] [get_bd_pins ps7_0_axi_periph/M16_ACLK] [get_bd_pins ps7_0_axi_periph/M17_ACLK] \
  [get_bd_pins ps7_0_axi_periph/M18_ACLK] [get_bd_pins ps7_0_axi_periph/M19_ACLK]
connect_bd_net -net axi_ethernet_0_dma_mm2s_introut [get_bd_pins In0] [get_bd_pins xlconcat_0/In0]
connect_bd_net -net axi_ethernet_0_dma_s2mm_introut [get_bd_pins In1] [get_bd_pins xlconcat_0/In1]
connect_bd_net -net axi_ethernet_0_interrupt [get_bd_pins In3] [get_bd_pins xlconcat_0/In3]
connect_bd_net -net axi_ethernet_0_mac_irq [get_bd_pins In2] [get_bd_pins xlconcat_0/In2]
connect_bd_net -net ipmc_jtag_irq [get_bd_pins In4] [get_bd_pins xlconcat_0/In4]
connect_bd_net -net ipmc_jtag_irq1 [get_bd_pins In6] [get_bd_pins xlconcat_0/In6]
connect_bd_net [get_bd_pins proc_sys_reset_0/peripheral_aresetn] \
  [get_bd_pins S00_ARESETN] [get_bd_pins ps7_0_axi_periph/ARESETN] [get_bd_pins ps7_0_axi_periph/S00_ARESETN] \
  [get_bd_pins ps7_0_axi_periph/M00_ARESETN] [get_bd_pins ps7_0_axi_periph/M01_ARESETN] \
  [get_bd_pins ps7_0_axi_periph/M02_ARESETN] [get_bd_pins ps7_0_axi_periph/M05_ARESETN] \
  [get_bd_pins ps7_0_axi_periph/M06_ARESETN] [get_bd_pins ps7_0_axi_periph/M07_ARESETN] \
  [get_bd_pins ps7_0_axi_periph/M08_ARESETN] [get_bd_pins ps7_0_axi_periph/M09_ARESETN] \
  [get_bd_pins ps7_0_axi_periph/M10_ARESETN] [get_bd_pins ps7_0_axi_periph/M11_ARESETN] \
  [get_bd_pins ps7_0_axi_periph/M12_ARESETN] [get_bd_pins ps7_0_axi_periph/M13_ARESETN] \
  [get_bd_pins ps7_0_axi_periph/M14_ARESETN] [get_bd_pins ps7_0_axi_periph/M15_ARESETN] \
  [get_bd_pins ps7_0_axi_periph/M16_ARESETN] [get_bd_pins ps7_0_axi_periph/M17_ARESETN] \
  [get_bd_pins ps7_0_axi_periph/M18_ARESETN] [get_bd_pins ps7_0_axi_periph/M19_ARESETN]
connect_bd_net [get_bd_pins proc_sys_reset_1/peripheral_aresetn] \
  [get_bd_pins peripheral_aresetn] [get_bd_pins ps7_0_axi_periph/M03_ARESETN] [get_bd_pins ps7_0_axi_periph/M04_ARESETN]
connect_bd_net [get_bd_pins processing_system7_0/FCLK_CLK1] \
  [get_bd_pins FCLK_CLK1] [get_bd_pins proc_sys_reset_1/slowest_sync_clk] [get_bd_pins ps7_0_axi_periph/M03_ACLK] \
  [get_bd_pins ps7_0_axi_periph/M04_ACLK]
connect_bd_net [get_bd_pins processing_system7_0/FCLK_CLK2] [get_bd_pins FCLK_CLK2]
connect_bd_net [get_bd_pins processing_system7_0/FCLK_RESET0_N] \
  [get_bd_pins ext_reset_in] [get_bd_pins proc_sys_reset_0/ext_reset_in] [get_bd_pins proc_sys_reset_1/ext_reset_in]
connect_bd_net [get_bd_pins xlconcat_0/dout] [get_bd_pins processing_system7_0/IRQ_F2P]
connect_bd_net [get_bd_pins xlconstant_0/dout] \
  [get_bd_pins processing_system7_0/SDIO0_CDN] [get_bd_pins processing_system7_0/SDIO0_WP] \
  [get_bd_pins processing_system7_0/SDIO1_CDN] [get_bd_pins processing_system7_0/SDIO1_WP]
set_property HDL_ATTRIBUTE.BMM_INFO_PROCESSOR {arm > design_1 bram_loopback/axi_bram_ctrl_0} [get_bd_cells processing_system7_0]
set_property HDL_ATTRIBUTE.KEEP_HIERARCHY yes [get_bd_cells processing_system7_0]

current_bd_instance /dbg
connect_bd_intf_net [get_bd_intf_pins debug_bridge_0/m0_bscan] [get_bd_intf_pins debug_bridge_1/S_BSCAN]
connect_bd_intf_net [get_bd_intf_pins S_AXI] [get_bd_intf_pins debug_bridge_0/S_AXI]
connect_bd_net [get_bd_pins clk] [get_bd_pins debug_bridge_0/s_axi_aclk] [get_bd_pins debug_bridge_1/clk]
connect_bd_net -net proc_sys_reset_0_peripheral_aresetn [get_bd_pins s_axi_aresetn] [get_bd_pins debug_bridge_0/s_axi_aresetn]

current_bd_instance /i2c
connect_bd_intf_net [get_bd_intf_pins iic_rtl_3] [get_bd_intf_pins axi_iic_3/IIC]
connect_bd_intf_net [get_bd_intf_pins iic_rtl_4] [get_bd_intf_pins axi_iic_4/IIC]
connect_bd_intf_net -intf_net S_AXI3_1 [get_bd_intf_pins S_AXI3] [get_bd_intf_pins axi_iic_3/S_AXI]
connect_bd_intf_net -intf_net S_AXI4_1 [get_bd_intf_pins S_AXI4] [get_bd_intf_pins axi_iic_4/S_AXI]
connect_bd_intf_net [get_bd_intf_pins iic_rtl_0] [get_bd_intf_pins axi_iic_0/IIC]
connect_bd_intf_net [get_bd_intf_pins iic_rtl_1] [get_bd_intf_pins axi_iic_1/IIC]
connect_bd_intf_net [get_bd_intf_pins iic_rtl_2] [get_bd_intf_pins axi_iic_2/IIC]
connect_bd_intf_net -intf_net cpu_M10_AXI [get_bd_intf_pins S_AXI2] [get_bd_intf_pins axi_iic_0/S_AXI]
connect_bd_intf_net -intf_net cpu_M11_AXI [get_bd_intf_pins S_AXI] [get_bd_intf_pins axi_iic_1/S_AXI]
connect_bd_intf_net -intf_net cpu_M12_AXI [get_bd_intf_pins S_AXI1] [get_bd_intf_pins axi_iic_2/S_AXI]
connect_bd_net [get_bd_pins s_axi_aclk] \
  [get_bd_pins axi_iic_0/s_axi_aclk] [get_bd_pins axi_iic_1/s_axi_aclk] [get_bd_pins axi_iic_2/s_axi_aclk] \
  [get_bd_pins axi_iic_3/s_axi_aclk] [get_bd_pins axi_iic_4/s_axi_aclk]
connect_bd_net [get_bd_pins axi_iic_0/iic2intc_irpt] [get_bd_pins iic2intc_irpt2]
connect_bd_net [get_bd_pins axi_iic_1/iic2intc_irpt] [get_bd_pins iic2intc_irpt]
connect_bd_net [get_bd_pins axi_iic_2/iic2intc_irpt] [get_bd_pins iic2intc_irpt1]
connect_bd_net [get_bd_pins axi_iic_3/iic2intc_irpt] [get_bd_pins iic2intc_irpt3]
connect_bd_net [get_bd_pins axi_iic_4/iic2intc_irpt] [get_bd_pins iic2intc_irpt4]
connect_bd_net -net proc_sys_reset_0_peripheral_aresetn [get_bd_pins s_axi_aresetn] \
  [get_bd_pins axi_iic_0/s_axi_aresetn] [get_bd_pins axi_iic_1/s_axi_aresetn] [get_bd_pins axi_iic_2/s_axi_aresetn] \
  [get_bd_pins axi_iic_3/s_axi_aresetn] [get_bd_pins axi_iic_4/s_axi_aresetn]

current_bd_instance /bram_loopback
connect_bd_intf_net [get_bd_intf_pins S_AXI] [get_bd_intf_pins axi_bram_ctrl_0/S_AXI]
connect_bd_intf_net [get_bd_intf_pins blk_mem_gen_0/BRAM_PORTA] [get_bd_intf_pins axi_bram_ctrl_0/BRAM_PORTA]
connect_bd_net [get_bd_pins S_AXI_ACLK] [get_bd_pins axi_bram_ctrl_0/s_axi_aclk]
connect_bd_net [get_bd_pins S_AXI_ARESETN] [get_bd_pins axi_bram_ctrl_0/s_axi_aresetn]
set_property HDL_ATTRIBUTE.BMM_INFO_ADDRESS_SPACE {byte  0x44000000 32 > design_1 bram_loopback/blk_mem_gen_0} [get_bd_cells axi_bram_ctrl_0]
set_property HDL_ATTRIBUTE.KEEP_HIERARCHY yes [get_bd_cells axi_bram_ctrl_0]

current_bd_instance /
connect_bd_intf_net [get_bd_intf_pins axi_jtag_0/s_axi] [get_bd_intf_pins cpu/M03_AXI]
connect_bd_intf_net -intf_net S_AXI2_1 [get_bd_intf_pins axi_bram_ctrl_0/S_AXI] [get_bd_intf_pins cpu/M05_AXI]
connect_bd_intf_net -intf_net S_AXI3_1 [get_bd_intf_pins axi_gpio_1/S_AXI] [get_bd_intf_pins cpu/M06_AXI]
connect_bd_intf_net -intf_net S_AXI4_1 [get_bd_intf_pins axi_bram_ctrl_1/S_AXI] [get_bd_intf_pins cpu/M07_AXI]
connect_bd_intf_net [get_bd_intf_pins axi_bram_ctrl_0/BRAM_PORTA] [get_bd_intf_pins i2cSlave_0/CONTROL]
connect_bd_intf_net -intf_net axi_bram_ctrl_0_BRAM_PORTA_1 [get_bd_intf_pins axi_bram_ctrl_1/BRAM_PORTA] [get_bd_intf_pins i2cSlave_1/CONTROL]
connect_bd_intf_net [get_bd_intf_pins axis_data_fifo_0/S_AXIS] [get_bd_intf_pins axi_dma_0/M_AXIS_MM2S]
connect_bd_intf_net [get_bd_intf_pins axi_dma_0/M_AXI_MM2S] [get_bd_intf_pins axi_mem_intercon/S01_AXI]
connect_bd_intf_net [get_bd_intf_pins axi_dma_0/M_AXI_S2MM] [get_bd_intf_pins axi_mem_intercon/S02_AXI]
connect_bd_intf_net [get_bd_intf_pins axi_dma_0/M_AXI_SG] [get_bd_intf_pins axi_mem_intercon/S00_AXI]
connect_bd_intf_net -intf_net axi_ethernet_0_mdio [get_bd_intf_ports mdio_phy] [get_bd_intf_pins eth1/mdio_phy]
connect_bd_intf_net -intf_net axi_ethernet_0_rgmii [get_bd_intf_ports rgmii] [get_bd_intf_pins eth1/rgmii]
connect_bd_intf_net -intf_net axi_iic_0_IIC [get_bd_intf_ports scf_i2c_0] [get_bd_intf_pins i2c/iic_rtl_0]
connect_bd_intf_net -intf_net axi_iic_1_IIC [get_bd_intf_ports scf_i2c_1] [get_bd_intf_pins i2c/iic_rtl_1]
connect_bd_intf_net -intf_net axi_iic_2_IIC [get_bd_intf_ports scf_i2c_2] [get_bd_intf_pins i2c/iic_rtl_2]
connect_bd_intf_net -intf_net axi_mem_intercon_M00_AXI [get_bd_intf_pins eth1/M00_AXI] [get_bd_intf_pins cpu/S_AXI_HP0]
connect_bd_intf_net [get_bd_intf_pins axi_mem_intercon/M00_AXI] [get_bd_intf_pins cpu/S_AXI_HP1]
connect_bd_intf_net [get_bd_intf_pins axis_data_fifo_0/M_AXIS] [get_bd_intf_pins axis_jtag_0/s_axis]
connect_bd_intf_net [get_bd_intf_pins axisafety_1/M_AXI] [get_bd_intf_pins axi_chip2chip_0/s_axi]
connect_bd_intf_net -intf_net axisafety_1_M_AXI_1 [get_bd_intf_pins axisafety_2/M_AXI] [get_bd_intf_pins axi_chip2chip_1/s_axi]
connect_bd_intf_net [get_bd_intf_pins cpu/IIC_0] [get_bd_intf_pins i2c_switch_dual_0/TX_MASTER]
connect_bd_intf_net [get_bd_intf_pins cpu/M04_AXI] [get_bd_intf_pins axi_jtag_1/s_axi]
connect_bd_intf_net [get_bd_intf_pins xadc_wiz_0/s_axi_lite] [get_bd_intf_pins cpu/M08_AXI]
connect_bd_intf_net [get_bd_intf_pins axi_dma_0/S_AXI_LITE] [get_bd_intf_pins cpu/M09_AXI]
connect_bd_intf_net [get_bd_intf_pins i2c/S_AXI2] [get_bd_intf_pins cpu/M10_AXI]
connect_bd_intf_net [get_bd_intf_pins i2c/S_AXI] [get_bd_intf_pins cpu/M11_AXI]
connect_bd_intf_net [get_bd_intf_pins i2c/S_AXI1] [get_bd_intf_pins cpu/M12_AXI]
connect_bd_intf_net [get_bd_intf_pins axi_gpio_0/S_AXI] [get_bd_intf_pins cpu/M13_AXI]
connect_bd_intf_net [get_bd_intf_pins cpu/M14_AXI] [get_bd_intf_pins axisafety_2/S_AXI]
connect_bd_intf_net [get_bd_intf_pins cpu/M16_AXI] [get_bd_intf_pins i2c/S_AXI3]
connect_bd_intf_net [get_bd_intf_pins cpu/M17_AXI] [get_bd_intf_pins i2c/S_AXI4]
connect_bd_intf_net [get_bd_intf_pins bram_loopback/S_AXI] [get_bd_intf_pins cpu/M18_AXI]
connect_bd_intf_net [get_bd_intf_pins axi_gpio_2/S_AXI] [get_bd_intf_pins cpu/M19_AXI]
connect_bd_intf_net [get_bd_intf_ports i2c_10g] [get_bd_intf_pins i2c/iic_rtl_3]
connect_bd_intf_net [get_bd_intf_ports local_i2c] [get_bd_intf_pins i2c/iic_rtl_4]
connect_bd_intf_net -intf_net ipmc_RX [get_bd_intf_pins i2c_switch_dual_0/RX0_SLAVE] [get_bd_intf_pins i2cSlave_0/RX]
connect_bd_intf_net -intf_net ipmc_RX1 [get_bd_intf_pins i2c_switch_dual_0/RX1_SLAVE] [get_bd_intf_pins i2cSlave_1/RX]
connect_bd_intf_net -intf_net processing_system7_0_DDR [get_bd_intf_ports DDR] [get_bd_intf_pins cpu/DDR]
connect_bd_intf_net -intf_net processing_system7_0_FIXED_IO [get_bd_intf_ports FIXED_IO] [get_bd_intf_pins cpu/FIXED_IO]
connect_bd_intf_net [get_bd_intf_pins cpu/M00_AXI] [get_bd_intf_pins eth1/s_axi]
connect_bd_intf_net [get_bd_intf_pins cpu/M01_AXI] [get_bd_intf_pins dbg/S_AXI]
connect_bd_intf_net [get_bd_intf_pins cpu/M02_AXI] [get_bd_intf_pins eth1/S_AXI_LITE]
connect_bd_intf_net [get_bd_intf_pins axisafety_1/S_AXI] [get_bd_intf_pins cpu/M15_AXI]
connect_bd_net -net ARESETN_1 [get_bd_pins cpu/interconnect_aresetn] [get_bd_pins eth1/ARESETN]
connect_bd_net -net AXIS_RX_0_tvalid_0_1 [get_bd_ports rxvalid_top] [get_bd_pins axi_chip2chip_1/axi_c2c_aurora_rx_tvalid]
connect_bd_net -net AXIS_RX_0_tvalid_1_1 [get_bd_ports rxvalid_bot] [get_bd_pins axi_chip2chip_0/axi_c2c_aurora_rx_tvalid]
connect_bd_net -net In1_0_1 [get_bd_ports los_10g] [get_bd_pins reg_bank_0/los_10g_10]
connect_bd_net -net In2_0_1 [get_bd_ports ha] \
  [get_bd_pins reg_bank_0/ha_7_0] [get_bd_pins i2cSlave_0/hardware_address] [get_bd_pins i2cSlave_1/hardware_address]
connect_bd_net -net In3_0_1 [get_bd_ports pim_alarm] [get_bd_pins reg_bank_0/pim_alarm_11]
connect_bd_net -net In8_0_1 [get_bd_ports hot_swap_sw] [get_bd_pins reg_bank_0/hot_swap_handle_16]
connect_bd_net [get_bd_pins cpu/FCLK_CLK0] \
  [get_bd_pins eth1/s_axi_lite_aclk] [get_bd_pins dbg/clk] [get_bd_pins i2c/s_axi_aclk] \
  [get_bd_pins bram_loopback/S_AXI_ACLK] [get_bd_ports axi_clk] [get_bd_pins pok_alarm_0/clk] \
  [get_bd_pins xadc_wiz_0/s_axi_aclk] [get_bd_pins axis_jtag_0/s_axis_aclk] [get_bd_pins i2c_switch_dual_0/clk] \
  [get_bd_pins ipmb_watchdog_0/clk] [get_bd_pins axi_bram_ctrl_0/s_axi_aclk] [get_bd_pins axi_bram_ctrl_1/s_axi_aclk] \
  [get_bd_pins axi_chip2chip_0/s_aclk] [get_bd_pins axi_chip2chip_0/aurora_init_clk] [get_bd_pins axi_chip2chip_1/s_aclk] \
  [get_bd_pins axi_chip2chip_1/aurora_init_clk] [get_bd_pins axi_dma_0/s_axi_lite_aclk] [get_bd_pins axi_dma_0/m_axi_sg_aclk] \
  [get_bd_pins axi_dma_0/m_axi_mm2s_aclk] [get_bd_pins axi_dma_0/m_axi_s2mm_aclk] [get_bd_pins axi_gpio_0/s_axi_aclk] \
  [get_bd_pins axi_gpio_1/s_axi_aclk] [get_bd_pins axi_gpio_2/s_axi_aclk] [get_bd_pins axi_mem_intercon/ACLK] \
  [get_bd_pins axi_mem_intercon/S00_ACLK] [get_bd_pins axi_mem_intercon/M00_ACLK] [get_bd_pins axi_mem_intercon/S01_ACLK] \
  [get_bd_pins axi_mem_intercon/S02_ACLK] [get_bd_pins axis_data_fifo_0/s_axis_aclk] [get_bd_pins i2cSlave_0/clk] \
  [get_bd_pins i2cSlave_1/clk] [get_bd_pins axisafety_1/S_AXI_ACLK] [get_bd_pins axisafety_1/M_AXI_ACLK] \
  [get_bd_pins axisafety_2/S_AXI_ACLK] [get_bd_pins axisafety_2/M_AXI_ACLK]
connect_bd_net [get_bd_ports ipmc_scl_0] [get_bd_pins i2c_switch_dual_0/scl0]
connect_bd_net [get_bd_ports ipmc_sda_0] [get_bd_pins i2c_switch_dual_0/sda0]
connect_bd_net [get_bd_ports ipmc_scl_1] [get_bd_pins i2c_switch_dual_0/scl1]
connect_bd_net [get_bd_ports ipmc_sda_1] [get_bd_pins i2c_switch_dual_0/sda1]
connect_bd_net -net TDO_0_0_1 [get_bd_ports scf_tdo_0] [get_bd_pins axi_jtag_0/TDO]
connect_bd_net -net TDO_1_0_1 [get_bd_ports scf_tdo_1] [get_bd_pins axi_jtag_1/TDO]
connect_bd_net -net aresetn_bot [get_bd_pins axisafety_1/comb_aresetn] [get_bd_pins axi_chip2chip_0/s_aresetn]
connect_bd_net -net aresetn_top [get_bd_pins axisafety_2/comb_aresetn] [get_bd_pins axi_chip2chip_1/s_aresetn]
connect_bd_net -net aurora_mmcm_not_locked_0_1 [get_bd_ports mgt_unlocked_top] [get_bd_pins axi_chip2chip_1/aurora_mmcm_not_locked]
connect_bd_net -net aurora_mmcm_not_locked_1_1 [get_bd_ports mgt_unlocked_bot] [get_bd_pins axi_chip2chip_0/aurora_mmcm_not_locked]
connect_bd_net -net axi_c2c_phy_clk_0_1 [get_bd_ports axi_c2c_phy_clk] \
  [get_bd_pins reg_bank_0/prbs_clk] [get_bd_pins axi_chip2chip_0/axi_c2c_phy_clk] \
  [get_bd_pins axi_chip2chip_1/axi_c2c_phy_clk]
connect_bd_net [get_bd_pins axi_chip2chip_0/axi_c2c_aurora_tx_tvalid] [get_bd_ports txvalid_bot]
connect_bd_net [get_bd_pins axi_chip2chip_1/axi_c2c_aurora_tx_tvalid] [get_bd_ports txvalid_top]
connect_bd_net [get_bd_pins axi_dma_0/mm2s_introut] [get_bd_pins cpu/In5]
connect_bd_net [get_bd_pins axi_dma_0/s2mm_introut] [get_bd_pins cpu/In12]
connect_bd_net -net axi_ethernet_0_dma_mm2s_introut [get_bd_pins eth1/mm2s_introut] [get_bd_pins cpu/In0]
connect_bd_net -net axi_ethernet_0_dma_s2mm_introut [get_bd_pins eth1/s2mm_introut] [get_bd_pins cpu/In1]
connect_bd_net -net axi_ethernet_0_interrupt [get_bd_pins eth1/interrupt] [get_bd_pins cpu/In3]
connect_bd_net -net axi_ethernet_0_mac_irq [get_bd_pins eth1/mac_irq] [get_bd_pins cpu/In2]
connect_bd_net -net axi_ethernet_0_phy_rst_n [get_bd_pins eth1/phy_rst] [get_bd_ports phy_rst]
connect_bd_net [get_bd_pins axi_gpio_0/gpio_io_o] [get_bd_pins reg_bank_0/reg_rw]
connect_bd_net [get_bd_pins axi_jtag_0/TCK] [get_bd_pins util_vector_logic_2/Op1]
connect_bd_net [get_bd_pins axi_jtag_0/TDI] [get_bd_pins util_vector_logic_1/Op1]
connect_bd_net [get_bd_pins axi_jtag_0/TMS] [get_bd_pins util_vector_logic_0/Op1]
connect_bd_net [get_bd_pins axi_jtag_1/TCK] [get_bd_pins util_vector_logic_5/Op1]
connect_bd_net [get_bd_pins axi_jtag_1/TDI] [get_bd_pins util_vector_logic_3/Op1]
connect_bd_net [get_bd_pins axi_jtag_1/TMS] [get_bd_pins util_vector_logic_4/Op1]
connect_bd_net [get_bd_pins axis_jtag_0/TCK_0] [get_bd_pins util_vector_logic_2/Op2]
connect_bd_net [get_bd_pins axis_jtag_0/TCK_1] [get_bd_pins util_vector_logic_5/Op2]
connect_bd_net [get_bd_pins axis_jtag_0/TDI_0] [get_bd_pins util_vector_logic_1/Op2]
connect_bd_net [get_bd_pins axis_jtag_0/TDI_1] [get_bd_pins util_vector_logic_3/Op2]
connect_bd_net [get_bd_pins axis_jtag_0/TMS_0] [get_bd_pins util_vector_logic_0/Op2]
connect_bd_net [get_bd_pins axis_jtag_0/TMS_1] [get_bd_pins util_vector_logic_4/Op2]
connect_bd_net [get_bd_pins axisafety_1/channel_up] [get_bd_pins axi_chip2chip_0/axi_c2c_aurora_channel_up]
connect_bd_net [get_bd_pins axisafety_2/channel_up] [get_bd_pins axi_chip2chip_1/axi_c2c_aurora_channel_up]
connect_bd_net -net chip2chip_bot_ff_aurora_do_cc [get_bd_pins axi_chip2chip_0/aurora_do_cc] [get_bd_ports do_cc_bot]
connect_bd_net -net chip2chip_top_ff_aurora_do_cc [get_bd_pins axi_chip2chip_1/aurora_do_cc] [get_bd_ports do_cc_top]
connect_bd_net [get_bd_pins cpu/peripheral_aresetn] [get_bd_pins axi_jtag_1/s_axi_aresetn] [get_bd_pins axi_jtag_0/s_axi_aresetn]
connect_bd_net -net cpu_peripheral_reset [get_bd_pins reg_bank_0/aurora_pma_init_9] \
  [get_bd_pins axi_chip2chip_0/aurora_pma_init_in] [get_bd_pins axi_chip2chip_1/aurora_pma_init_in]
connect_bd_net [get_bd_pins i2c/iic2intc_irpt] [get_bd_pins cpu/In7]
connect_bd_net [get_bd_pins i2c/iic2intc_irpt1] [get_bd_pins cpu/In8]
connect_bd_net [get_bd_pins i2c/iic2intc_irpt2] [get_bd_pins cpu/In9]
connect_bd_net [get_bd_pins i2c/iic2intc_irpt3] [get_bd_pins cpu/In10]
connect_bd_net [get_bd_pins i2c/iic2intc_irpt4] [get_bd_pins cpu/In11]
connect_bd_net [get_bd_pins i2c_switch_dual_0/ms_scl_o] [get_bd_pins ipmb_watchdog_0/ms_scl_o]
connect_bd_net [get_bd_pins i2c_switch_dual_0/ms_scl_t] [get_bd_pins ipmb_watchdog_0/ms_scl_t]
connect_bd_net [get_bd_pins i2c_switch_dual_0/ms_sda_o] [get_bd_pins ipmb_watchdog_0/ms_sda_o]
connect_bd_net [get_bd_pins i2c_switch_dual_0/ms_sda_t] [get_bd_pins ipmb_watchdog_0/ms_sda_t]
connect_bd_net [get_bd_pins i2c_switch_dual_0/scl_i_out] [get_bd_pins ipmb_watchdog_0/scl_i_in]
connect_bd_net [get_bd_pins i2c_switch_dual_0/scl_t_out] [get_bd_pins ipmb_watchdog_0/scl_t_in]
connect_bd_net [get_bd_pins i2c_switch_dual_0/sda_i_out] [get_bd_pins ipmb_watchdog_0/sda_i_in]
connect_bd_net [get_bd_pins i2c_switch_dual_0/sda_t_out] [get_bd_pins ipmb_watchdog_0/sda_t_in]
connect_bd_net [get_bd_pins i2c_switch_dual_0/sv_scl_o] [get_bd_pins ipmb_watchdog_0/sv_scl_o]
connect_bd_net [get_bd_pins i2c_switch_dual_0/sv_scl_t] [get_bd_pins ipmb_watchdog_0/sv_scl_t]
connect_bd_net [get_bd_pins i2c_switch_dual_0/sv_sda_o] [get_bd_pins ipmb_watchdog_0/sv_sda_o]
connect_bd_net [get_bd_pins i2c_switch_dual_0/sv_sda_t] [get_bd_pins ipmb_watchdog_0/sv_sda_t]
connect_bd_net -net ipmb_rdy [get_bd_ports ready_ipmb_zynq] [get_bd_pins reg_bank_0/ready_ipmb_zynq_9_8]
connect_bd_net [get_bd_pins ipmb_watchdog_0/gpio_0] [get_bd_pins axi_gpio_2/gpio_io_i]
connect_bd_net [get_bd_pins ipmb_watchdog_0/gpio_1] [get_bd_pins axi_gpio_2/gpio2_io_i]
connect_bd_net -net ipmc_gpio_io_o [get_bd_pins axi_gpio_1/gpio_io_o] [get_bd_pins i2c_switch_dual_0/tx_en]
connect_bd_net -net ipmc_jtag_irq [get_bd_pins i2cSlave_0/irq] [get_bd_pins cpu/In4]
connect_bd_net -net ipmc_jtag_irq1 [get_bd_pins i2cSlave_1/irq] [get_bd_pins cpu/In6]
connect_bd_net -net link_stat_bot [get_bd_pins axi_chip2chip_0/axi_c2c_link_status_out] \
  [get_bd_ports link_up_bot] [get_bd_pins reg_bank_0/link_stat_bot_14]
connect_bd_net -net link_stat_top [get_bd_pins axi_chip2chip_1/axi_c2c_link_status_out] \
  [get_bd_ports link_up_top] [get_bd_pins reg_bank_0/link_stat_top_12]
connect_bd_net [get_bd_pins pok_alarm_0/payload_off_alarm] [get_bd_pins reg_bank_0/payload_off_alarm_27_25]
connect_bd_net [get_bd_pins pok_alarm_0/payload_on_out] [get_bd_ports qbv_on_off]
connect_bd_net -net pok_change_0_1 [get_bd_ports pok_change] [get_bd_pins pok_alarm_0/pok_change] [get_bd_pins reg_bank_0/pok_change_31_29]
connect_bd_net -net pok_payload_28_0_1 [get_bd_ports pok_payload] [get_bd_pins reg_bank_0/pok_payload_28]
connect_bd_net -net prbs_sel [get_bd_pins reg_bank_0/prbs_sel_8_6] [get_bd_ports prbs_sel]
connect_bd_net -net probe0_0_1 [get_bd_ports prbs_err] [get_bd_pins reg_bank_0/prbs_err_20_17]
connect_bd_net -net proc_sys_reset_0_peripheral_aresetn [get_bd_pins cpu/S00_ARESETN] \
  [get_bd_pins eth1/axi_resetn] [get_bd_pins dbg/s_axi_aresetn] [get_bd_pins i2c/s_axi_aresetn] \
  [get_bd_pins bram_loopback/S_AXI_ARESETN] [get_bd_pins xadc_wiz_0/s_axi_aresetn] \
  [get_bd_pins axi_bram_ctrl_0/s_axi_aresetn] [get_bd_pins axi_bram_ctrl_1/s_axi_aresetn] [get_bd_pins axi_dma_0/axi_resetn] \
  [get_bd_pins axi_gpio_0/s_axi_aresetn] [get_bd_pins axi_gpio_1/s_axi_aresetn] [get_bd_pins axi_gpio_2/s_axi_aresetn] \
  [get_bd_pins axi_mem_intercon/ARESETN] [get_bd_pins axi_mem_intercon/S00_ARESETN] \
  [get_bd_pins axi_mem_intercon/M00_ARESETN] [get_bd_pins axi_mem_intercon/S01_ARESETN] \
  [get_bd_pins axi_mem_intercon/S02_ARESETN] [get_bd_pins axis_data_fifo_0/s_axis_aresetn] [get_bd_pins i2cSlave_0/rst] \
  [get_bd_pins i2cSlave_1/rst] [get_bd_pins axisafety_1/S_AXI_ARESETN] [get_bd_pins axisafety_2/S_AXI_ARESETN]
connect_bd_net -net processing_system7_0_FCLK_CLK1 [get_bd_pins cpu/FCLK_CLK1] \
  [get_bd_pins eth1/ref_clk] [get_bd_pins axi_jtag_1/s_axi_aclk] [get_bd_pins axi_jtag_0/s_axi_aclk]
connect_bd_net -net processing_system7_0_FCLK_CLK2 [get_bd_pins cpu/FCLK_CLK2] [get_bd_pins eth1/gtx_clk]
connect_bd_net -net processing_system7_0_FCLK_RESET0_N [get_bd_pins cpu/ext_reset_in] [get_bd_pins eth1/ext_reset_in]
connect_bd_net -net reg_bank_0_c2c_slave_reset [get_bd_pins reg_bank_0/c2c_slave_reset_top_16] [get_bd_ports c2c_slave_reset_top]
connect_bd_net [get_bd_pins reg_bank_0/c2c_slave_reset_bot_18] [get_bd_ports c2c_slave_reset_bot]
connect_bd_net -net reg_bank_0_channel_jtag_26 [get_bd_pins reg_bank_0/jtag_channel_26] [get_bd_pins axis_jtag_0/channel]
connect_bd_net [get_bd_pins reg_bank_0/channel_up_bot_17] \
  [get_bd_pins reg_bank_0/channel_up_bot_15] [get_bd_pins axi_chip2chip_0/axi_c2c_aurora_tx_tready] \
  [get_bd_pins axisafety_1/ext_resetn]
connect_bd_net [get_bd_pins reg_bank_0/channel_up_top_15] \
  [get_bd_pins reg_bank_0/channel_up_top_13] [get_bd_pins axi_chip2chip_1/axi_c2c_aurora_tx_tready] \
  [get_bd_pins axisafety_2/ext_resetn]
connect_bd_net [get_bd_pins reg_bank_0/payload_on_5] [get_bd_pins pok_alarm_0/payload_on_in]
connect_bd_net [get_bd_pins reg_bank_0/pok_change_enable_25_23] [get_bd_pins pok_alarm_0/pok_change_enable]
connect_bd_net [get_bd_pins reg_bank_0/pok_change_polarity_22_20] [get_bd_pins pok_alarm_0/pok_change_polarity]
